# Altium project NOT GATES.PrjPcb
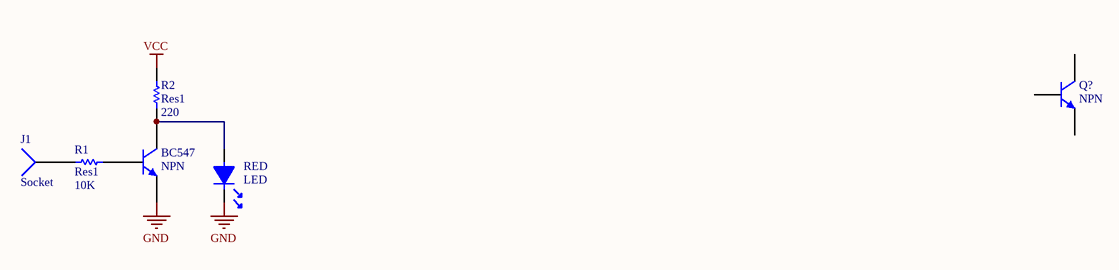
[diagram p0: NOT GATES.SchDoc]
1 sheet, 6 parts. Net scope: global (net labels, ports and power ports of the same name join across sheets).

## Sheet NOT GATES.SchDoc
size A4

### Parts
BC547  NPN  [TO-226-AA]
J1  Socket  [PIN1]
Q?  NPN  [TO-226-AA]
R1  Res1  value 10K  [AXIAL-0.3]
R2  Res1  value 220  [AXIAL-0.3]
RED  LED  [LED3]

### Nets
GND: BC547.3(E) RED.2
VCC: R2.2
NetBC547_1: BC547.1(C) R2.1 RED.1
NetBC547_2: BC547.2(B) R1.2
NetJ1_1: J1.1 R1.1

Not connected (* = marked no-connect by the designer): Q? 1(C) 2(B) 3(E)

### Library data of the parts
BC547 Q? = NPN: NPN Bipolar Transistor; Published: 8-Jun-2000; LatestRevisionDate: 17-Jul-2002; LatestRevisionNote: Re-released for DXP Platform.; PackageReference: TO-226-AA; Publisher: Altium Limited; PackageDescription: TO, Flat Index; 3 In-Line, Axial Leads; Body Dia. 4.8mm; Leads 0.55 x 0.51 mm (max); Code_JEDEC: TO-226-AA
R1 R2 = Res1: Resistor; Published: 8-Jun-2000; LatestRevisionDate: 17-Jul-2002; LatestRevisionNote: Re-released for DXP Platform.; PackageReference: AXIAL-0.3; Publisher: Altium Limited; PackageDescription: Axial Device, Thru-Hole; 2 Leads; 0.3 in Pin Spacing
J1 = Socket: LatestRevisionDate: 17-Jul-2002; LatestRevisionNote: Re-released for DXP Platform.; Publisher: Altium Limited